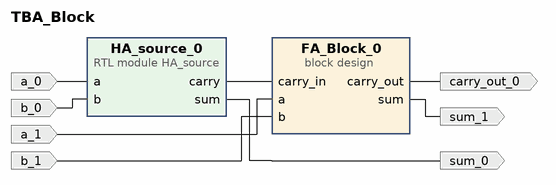
[diagram p0: block diagram of the top level]
# Vivado block design TBA_Block, xc7a100tcsg324-1, Vivado 2021.1
create_bd_design TBA_Block

create_bd_port -dir I a_0
create_bd_port -dir I b_0
create_bd_port -dir I b_1
create_bd_port -dir I a_1
create_bd_port -dir O sum_0
create_bd_port -dir O sum_1
create_bd_port -dir O carry_out_0

create_bd_cell -type container -reference FA_Block FA_Block_0
set_property -dict [list \
  CONFIG.ACTIVE_SIM_BD FA_Block.bd \
  CONFIG.ACTIVE_SYNTH_BD FA_Block.bd \
  CONFIG.ENABLE_DFX 0 \
  CONFIG.LIST_SIM_BD FA_Block.bd \
  CONFIG.LIST_SYNTH_BD FA_Block.bd \
  CONFIG.LOCK_PROPAGATE 0 \
] [get_bd_cells FA_Block_0]
create_bd_cell -type module -reference HA_source HA_source_0

# ---- connections ----

connect_bd_net [get_bd_pins FA_Block_0/carry_out] [get_bd_ports carry_out_0]
connect_bd_net [get_bd_pins FA_Block_0/sum] [get_bd_ports sum_1]
connect_bd_net [get_bd_pins HA_source_0/carry] [get_bd_pins FA_Block_0/carry_in]
connect_bd_net [get_bd_pins HA_source_0/sum] [get_bd_ports sum_0]
connect_bd_net -net a_0_1 [get_bd_ports a_0] [get_bd_pins HA_source_0/a]
connect_bd_net -net a_1_1 [get_bd_ports a_1] [get_bd_pins FA_Block_0/a]
connect_bd_net -net b_0_1 [get_bd_ports b_0] [get_bd_pins HA_source_0/b]
connect_bd_net -net b_1_1 [get_bd_ports b_1] [get_bd_pins FA_Block_0/b]

validate_bd_design
save_bd_design
